# EAGLE design BOTTOM_1P (EAGLE 9.6.2)
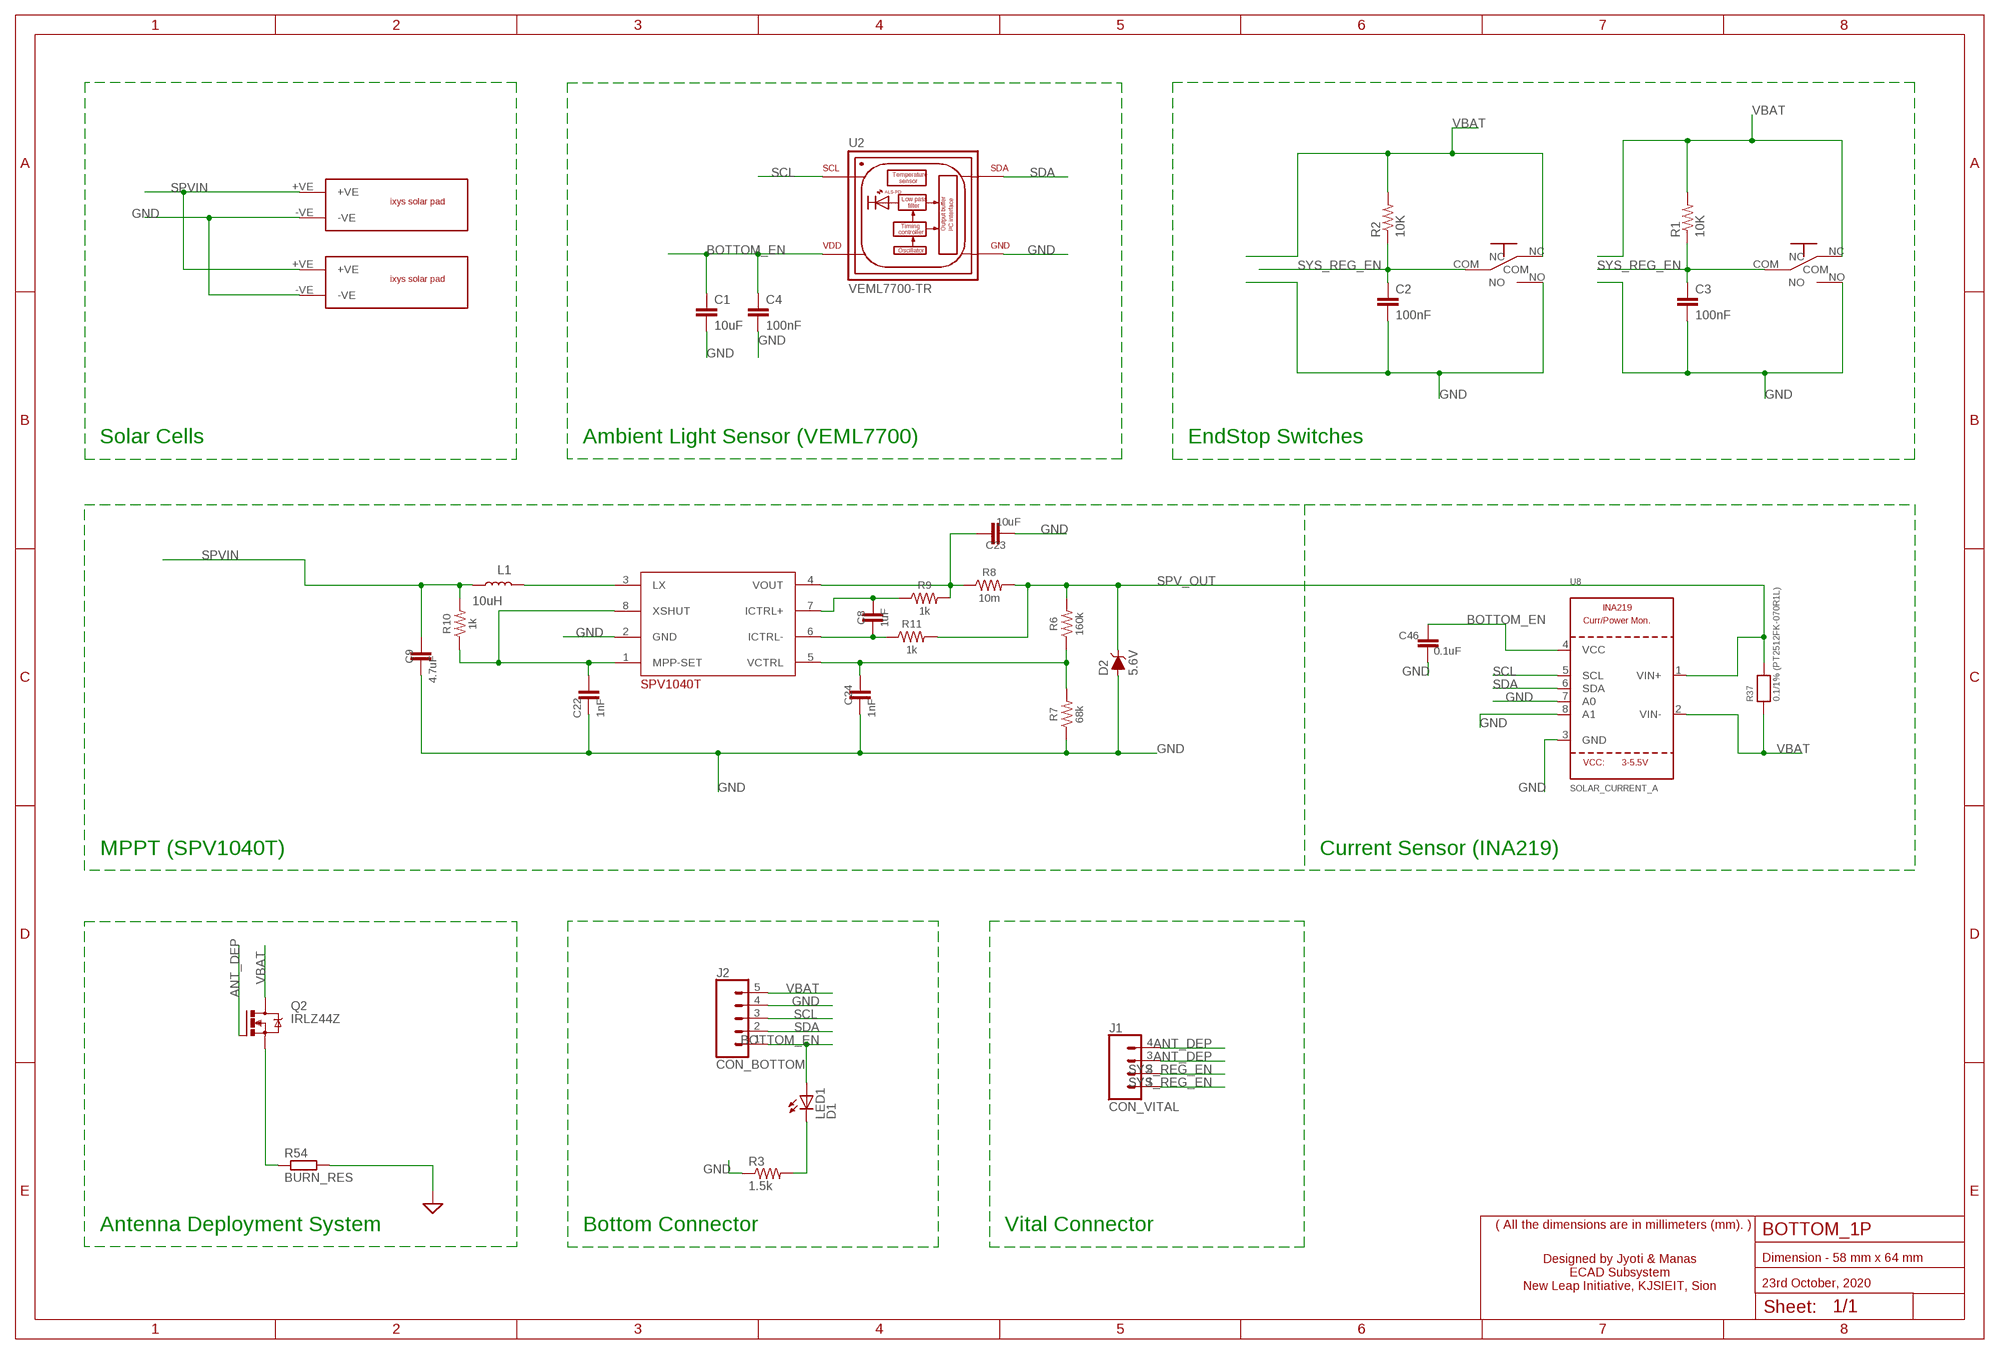
[diagram p0: schematic, sheet 1]

## Parts
C1  10uF  2.2NF/2200PF-0603-50V-10%  [0603]
C2  100nF  CAP0805  [0805]
C3  100nF  CAP0805  [0805]
C4  100nF  2.2NF/2200PF-0603-50V-10%  [0603]
C8  1uF  10UF-0603-6.3V-20%  [0603]
C9  4.7uF  10UF-0603-6.3V-20%  [0603]
C22  1nF  10UF-0603-6.3V-20%  [0603]
C23  10uF  10UF-0603-6.3V-20%  [0603]
C24  1nF  10UF-0603-6.3V-20%  [0603]
C46  0.1uF  10UF-0603-6.3V-20%  [0603]
D2  5.6V  DIODE-ZENER-MMSZ5232BS  [SOD-323]
ES1  OMRON-D2FA  [OMRON-D2F-A]
ES2  OMRON-D2FA  [OMRON-D2F-A]
J1  CON_VITAL  CONN_041.27MM  [1X04_1.27MM]
J2  CON_BOTTOM  CONN_051.27MM  [1X05_1.27MM]
L1  10uH  INDUCTOR-0603-33NH  [0603]
LED1  D1  LEDCHIP-LED0603  [CHIP-LED0603]
Q2  IRLZ44Z  [TO220BH]
R1  10K  RESISTOR  [0805]
R2  10K  RESISTOR  [0805]
R3  1.5k  R-US_R0603  [R0603]
R6  160k  RC0603JR-070RL  [RES_0603]
R7  68k  RC0603JR-070RL  [RES_0603]
R8  10m  RC0603JR-070RL  [RES_0603]
R9  1k  RC0603JR-070RL  [RES_0603]
R10  1k  RC0603JR-070RL  [RES_0603]
R11  1k  RC0603JR-070RL  [RES_0603]
R37  0.1/1% (PT2512FK-070R1L)  RESISTOR2512  [2512]
R54  BURN_RES  R-EU_0204/2V  [0204V]
SPV_A  SPV1040T_  [SOP65P640X120-8N]
U2  VEML7700-TR  [XDCR_VEML7700-TR]
U8  SOLAR_CURRENT_A  INA219  [SOT23-8]
U$1  IXYS  [IXYS]
U$2  IXYS  [IXYS]

## Nets
ANT_DEP: J1.3 J1.4 Q2.G
BOTTOM_EN: C1.1 C4.1 C46.1 J2.1 LED1.A U2.2(VDD) U8.4(VCC)
GND [vcc]: C1.2 C2.2 C3.2 C4.2 C9.2 C22.2 C23.2 C24.2 C46.2 D2.A ES1.NO ES2.NO J2.4 R3.1 R7.1 R54.2 SPV_A.2(GND) U2.3(GND) U8.3(GND) U8.7(A0) U8.8(A1) U$1.-VE U$2.-VE ; supply symbol labelled SUP
N$1: LED1.C R3.2
N$10: L1.2 SPV_A.3(LX)
N$19: Q2.S R54.1
N$31: C22.1 R10.1 SPV_A.1(MPP-SET) SPV_A.8(XSHUT)
N$32: C24.1 R6.1 R7.2 SPV_A.5(VCTRL)
N$34: C8.2 R11.1 SPV_A.6(ICTRL-)
N$35: C8.1 R9.1 SPV_A.7(ICTRL+)
N$36: C23.1 R8.1 R9.2 SPV_A.4(VOUT)
SCL: J2.3 U2.1(SCL) U8.5(SCL)
SDA: J2.2 U2.4(SDA) U8.6(SDA)
SPV_OUT: D2.C R6.2 R8.2 R11.2 R37.2 U8.1(VIN+)
SPVIN: C9.1 L1.1 R10.2 U$1.+VE U$2.+VE
SYS_REG_EN: C2.1 C3.1 ES1.COM ES2.COM J1.1 J1.2 R1.1 R2.1
VBAT: ES1.NC ES2.NC J2.5 Q2.D R1.2 R2.2 R37.1 U8.2(VIN-)

## Notes on the sheet
- Solar Cells | Ambient Light Sensor (VEML7700) | EndStop Switches
- MPPT (SPV1040T) | Current Sensor (INA219)
- Antenna Deployment System | Bottom Connector | Vital Connector | ( All the dimensions are in millimeters (mm). )
- Dimension - 58 mm x 64 mm
- Designed by Jyoti & Manas
  ECAD Subsystem
  New Leap Initiative, KJSIEIT, Sion
- 23rd October, 2020

## Library data of the parts
C1 C4 = SparkFun-Capacitors:2.2NF/2200PF: 2.2nF/2,200pF ceramic capacitors A capacitor is a passive two-terminal electrical component used to store electrical energy temporarily in an electric field.; PROD_ID: CAP-07877; VALUE: 2.2nF
C2 C3 = SparkFun:CAP: Capacitor Standard 0603 ceramic capacitor, and 0.1" leaded capacitor.
C8 C9 C22 C24 C46 = SparkFun-Capacitors:10UF: 10.0µF ceramic capacitors A capacitor is a passive two-terminal electrical component used to store electrical energy temporarily in an electric field.; PROD_ID: CAP-11015; VALUE: 10uF
C23 = SparkFun-Capacitors:10UF: 10.0µF ceramic capacitors A capacitor is a passive two-terminal electrical component used to store electrical energy temporarily in an electric field.; PROD_ID: CAP-11015
D2 = SparkFun-DiscreteSemi:DIODE-ZENER: Zener Diode A Zener diode allows current to flow from its anode to its cathode like a normal semiconductor diode, but it also permits current to flow in the reverse direction when its "Zener voltage" is reached. - WIkipedia; PROD_ID: DIO-12442
ES1 ES2 = reprap:OMRON-D2F
J1 = SparkFun-Connectors:CONN_04: Multi connection point. Often used as Generic Header-pin footprint for 0.1 inch spaced/style header connections On any of the 0.1 inch spaced packages, you can populate with these: Break Away Headers - Straight <https://www.sparkfun.com/products/116> (PRT-00116) Break Away Male Headers - Right Angle <https://www.sparkfun.com/products/553> (PRT-00553) Female Headers <https://www.sparkfun.com/products/115> (PRT-00115) Break Away Headers - Machine Pin <https://www.sparkfun.com/products/117> (PRT-00117) Break Away Female Headers - Swiss Machine Pin <https://www.sparkfun.com/products/743> (PRT-00743) For SCREWTERMINALS and SPRING TERMINALS visit here: Screw Terimnals on SparkFun.com <https://www.sparkfun.com/search/results?term=Screw+Terminals> (5mm/3.5mm/2.54mm spacing) This device is also useful as a general connection point to wire up your design to another part of your project. Our various solder wires solder well into these plated through hole pads. Hook-Up Wire - Assortment (Stranded, 22 AWG) <https://www.sparkfun.com/products/11375> (PRT-11375) Hook-Up Wire - Assortment (Solid Core, 22 AWG) <https://www.sparkfun.com/products/11367> (PRT-11367) View the entire wire category on our website here <https://www.sparkfun.com/categories/141> Special notes: Molex polarized connector foot print use with SKU : PRT-08231 with associated crimp pins and housings. 1MM SMD Version SKU: PRT-10208
J2 = SparkFun-Connectors:CONN_05: Multi connection point. Often used as Generic Header-pin footprint for 0.1 inch spaced/style header connections On any of the 0.1 inch spaced packages, you can populate with these: Break Away Headers - Straight <https://www.sparkfun.com/products/116> (PRT-00116) Break Away Male Headers - Right Angle <https://www.sparkfun.com/products/553> (PRT-00553) Female Headers <https://www.sparkfun.com/products/115> (PRT-00115) Break Away Headers - Machine Pin <https://www.sparkfun.com/products/117> (PRT-00117) Break Away Female Headers - Swiss Machine Pin <https://www.sparkfun.com/products/743> (PRT-00743) For SCREWTERMINALS and SPRING TERMINALS visit here: Screw Terimnals on SparkFun.com <https://www.sparkfun.com/search/results?term=Screw+Terminals> (5mm/3.5mm/2.54mm spacing) This device is also useful as a general connection point to wire up your design to another part of your project. Our various solder wires solder well into these plated through hole pads. Hook-Up Wire - Assortment (Stranded, 22 AWG) <https://www.sparkfun.com/products/11375> (PRT-11375) Hook-Up Wire - Assortment (Solid Core, 22 AWG) <https://www.sparkfun.com/products/11367> (PRT-11367) View the entire wire category on our website here <https://www.sparkfun.com/categories/141> Special notes: Molex polarized connector foot print use with SKU : PRT-08231 with associated crimp pins and housings. 1MM SMD Version SKU: PRT-10208
L1 = SparkFun-Coils:INDUCTOR: Inductors Resist changes in electrical current. Basically a coil of wire. SparkFun Products: SparkFun Load Cell Amplifier - HX711 <https://www.sparkfun.com/products/13879> IOIO-OTG - V2.2 <https://www.sparkfun.com/products/13613>; PROD_ID: NDUC-07874; VALUE: 33nH/±5%/500mA
LED1 = adafruit:LED: LED OSRAM: - CHIPLED LG R971, LG N971, LY N971, LG Q971, LY Q971, LO R971, LY R971 LH N974, LH R974 LS Q976, LO Q976, LY Q976 LO Q996 - Hyper CHIPLED LW Q18S LB Q993, LB Q99A, LB R99A - SideLED LS A670, LO A670, LY A670, LG A670, LP A670 LB A673, LV A673, LT A673, LW A673 LH A674 LY A675 LS A676, LA A676, LO A676, LY A676, LW A676 LS A679, LY A679, LG A679 - Hyper Micro SIDELED® LS Y876, LA Y876, LO Y876, LY Y876 LT Y87S - SmartLED LW L88C, LW L88S LB L89C, LB L89S, LG L890 LS L89K, LO L89K, LY L89K LS L896, LA L896, LO L896, LY L896 - TOPLED LS T670, LO T670, LY T670, LG T670, LP T670 LSG T670, LSP T670, LSY T670, LOP T670, LYG T670 LG T671, LOG T671, LSG T671 LB T673, LV T673, LT T673, LW T673 LH T674 LS T676, LA T676, LO T676, LY T676, LB T676, LH T676, LSB T676, LW T676 LB T67C, LV T67C, LT T67C, LS T67K, LO T67K, LY T67K, LW E67C LS E67B, LA E67B, LO E67B, LY E67B, LB E67C, LV E67C, LT E67C LW T67C LS T679, LY T679, LG T679 LS T770, LO T770, LY T770, LG T770, LP T770 LB T773, LV T773, LT T773, LW T773 LH T774 LS E675, LA E675, LY E675, LS T675 LS T776, LA T776, LO T776, LY T776, LB T776 LHGB T686 LT T68C, LB T68C - Hyper Mini TOPLED® LB M676 - Mini TOPLED Santana® LG M470 LS M47K, LO M47K, LY M47K Source: http://www.osram.convergy.de/
Q2 = transistor-power:IRLZ44Z: N-Channel HEXFET® Power MOSFET Logic Level AUTOMOTIVE MOSFET Source: http://www.irf.com/product-info/datasheets/data/irlz44zpbf.pdf
R1 R2 = SparkFun:RESISTOR: Resistor Basic schematic elements and footprints for 0603, 1206, and PTH 1/10th watt (small) resistors.
R3 = adafruit:R-US_: RESISTOR, American symbol
R6-R11 = Resistor_Capacitor:RC0603JR-070RL: RES SMD 0 OHM JUMPER 1/10W 0603 Manufacturer's datasheet <http://www.yageo.com/documents/recent/PYu-RC_Group_51_RoHS_L_10.pdf>; CREATED_BY: PCBLayout.com; DIGIKEY_PART_NUMBER: 311-0.0GRTR-ND; MANUFACTURER: Yageo; MPN: RC0603JR-070RL; PACKAGE: SMD 0603
R37 = microbuilder:RESISTOR: Resistors 0402 - 0402 Surface Mount Package 22 Ohm 1% 1/16W [Digikey: 311-22.0LRTR-ND] 33 Ohm 5% 1/16W 1.0K 5% 1/16W 1.5K 5% 1/16W 2.0K 1% 1/16W 10.0K 1% 1/16W [Digikey: 311-10.0KLRTR-ND] 10.0K 5% 1/16W [Digikey: RMCF0402JT10K0TR-ND] 12.1K 1% 1/16W [Digikey: 311-22.0LRTR-ND] 100.0K 5% 1/16W 0603 - 0603 Surface Mount Package 0 Ohm 1/10 Watt 1% Resistor 15 Ohm 1/10 Watt 1% Resistor 33 Ohm 1/10 Watt 1% Resistor 49.9 Ohm 1/10 Watt 1% Resistor 100 Ohm 1/10 Watt 1% Resistor 150 Ohm 1/10 Watt 1% Resistor 240 Ohm 1/10 Watt 1% Resistor 390 Ohm 1/10 Watt 1% Resistor 560 Ohm 1/10 Watt 1% Resistor 680 Ohm 1/10 Watt 1% Resistor 750 Ohm 1/10 Watt 1% Resistor 1.0K Ohm 1/10 Watt 1% Resistor 1.5K Ohm 1/10 Watt 1% Resistor 2.0K Ohm 1/10 Watt 1% Resistor 2.2K Ohm 1/10 Watt 1% Resistor 3.3K Ohm 1/10 Watt 1% Resistor 4.7K Ohm 1/10 Watt 1% Resistor 10.0K Ohm 1/10 Watt 1% Resistor 12.0K Ohm 1/10 Watt 1% Resistor 12.1K Ohm 1/10 Watt 1% Resistor 20.0K Ohm 1/10 Watt 1% Resistor 33.0K Ohm 1/10 Watt 1% Resistor 100.0K Ohm 1/10 Watt 1% Resistor 0805 - 0805 Surface Mount Package 0 Ohm 1/8 Watt 1% Resistor 33 Ohm 1/8 Watt 1% Resistor 100 Ohm 1/8 Watt 1% Resistor 150 Ohm 1/8 Watt 1% Resistor 200 Ohm 1/8 Watt 1% Resistor 240 Ohm 1/8 Watt 1% Resistor 330 Ohm 1/8 Watt 1% Resistor 390 Ohm 1/8 Watt 1% Resistor 470 Ohm 1/8 Watt 1% Resistor 1.0K Ohm 1/8 Watt 1% Resistor 1.5K Ohm 1/8 Watt 1% Resistor 2.0K Ohm 1/8 Watt 1% Resistor 4.7K Ohm 1/8 Watt 1% Resistor 5.1K Ohm 1/8 Watt 1% Resistor 5.6K Ohm 1/8 Watt 1% Resistor 10.0K Ohm 1/8 Watt 1% Resistor 22.0K Ohm 1/8 Watt 1% Resistor 33.0K Ohm 1/8 Watt 1% Resistor 100K Ohm 1/8 Watt 1% Resistor 1206 - 1206 Surface Mount Package 2012 - 2010 Surface Mount Package 0.11 Ohm 1/2 Watt 1% Resistor - Digikey: RHM.11UCT-ND
R54 = rcl:R-EU_: RESISTOR, European symbol; SPICEPREFIX: R
SPV_A = SPV1040T:SPV1040T_
U2 = VEML7700-TR:VEML7700-TR: Light to Digital Ambient Light Sensor Digital 0lux to 167000lux 8-Pin SMD T/R; ARROW_ELECTRONICS-PURCHASE-URL: https://snapeda.com/shop?store=Arrow+Electronics&id=620383; DESCRIPTION: Optical Sensor Ambient 545nm I²C 4-SMD, J-Lead; DIGI-KEY_PART_NUMBER: VEML7700CT-ND; DIGIKEY-PURCHASE-URL: https://snapeda.com/shop?store=DigiKey&id=620383; MF: Vishay; MOUSER-PURCHASE-URL: https://snapeda.com/shop?store=Mouser&id=620383; MP: VEML7700-TR; PACKAGE: SMD-4 Vishay
U8 = microbuilder:INA219: INA219 - I2C Current/Power Monitor Voltage Range: 0-26V Accuracy: 0.5% Temperature: -40°C - 125°C
U$1 U$2 = ixys:IXYS

## Net classes
1 vcc: width 0.254 mm

## Board
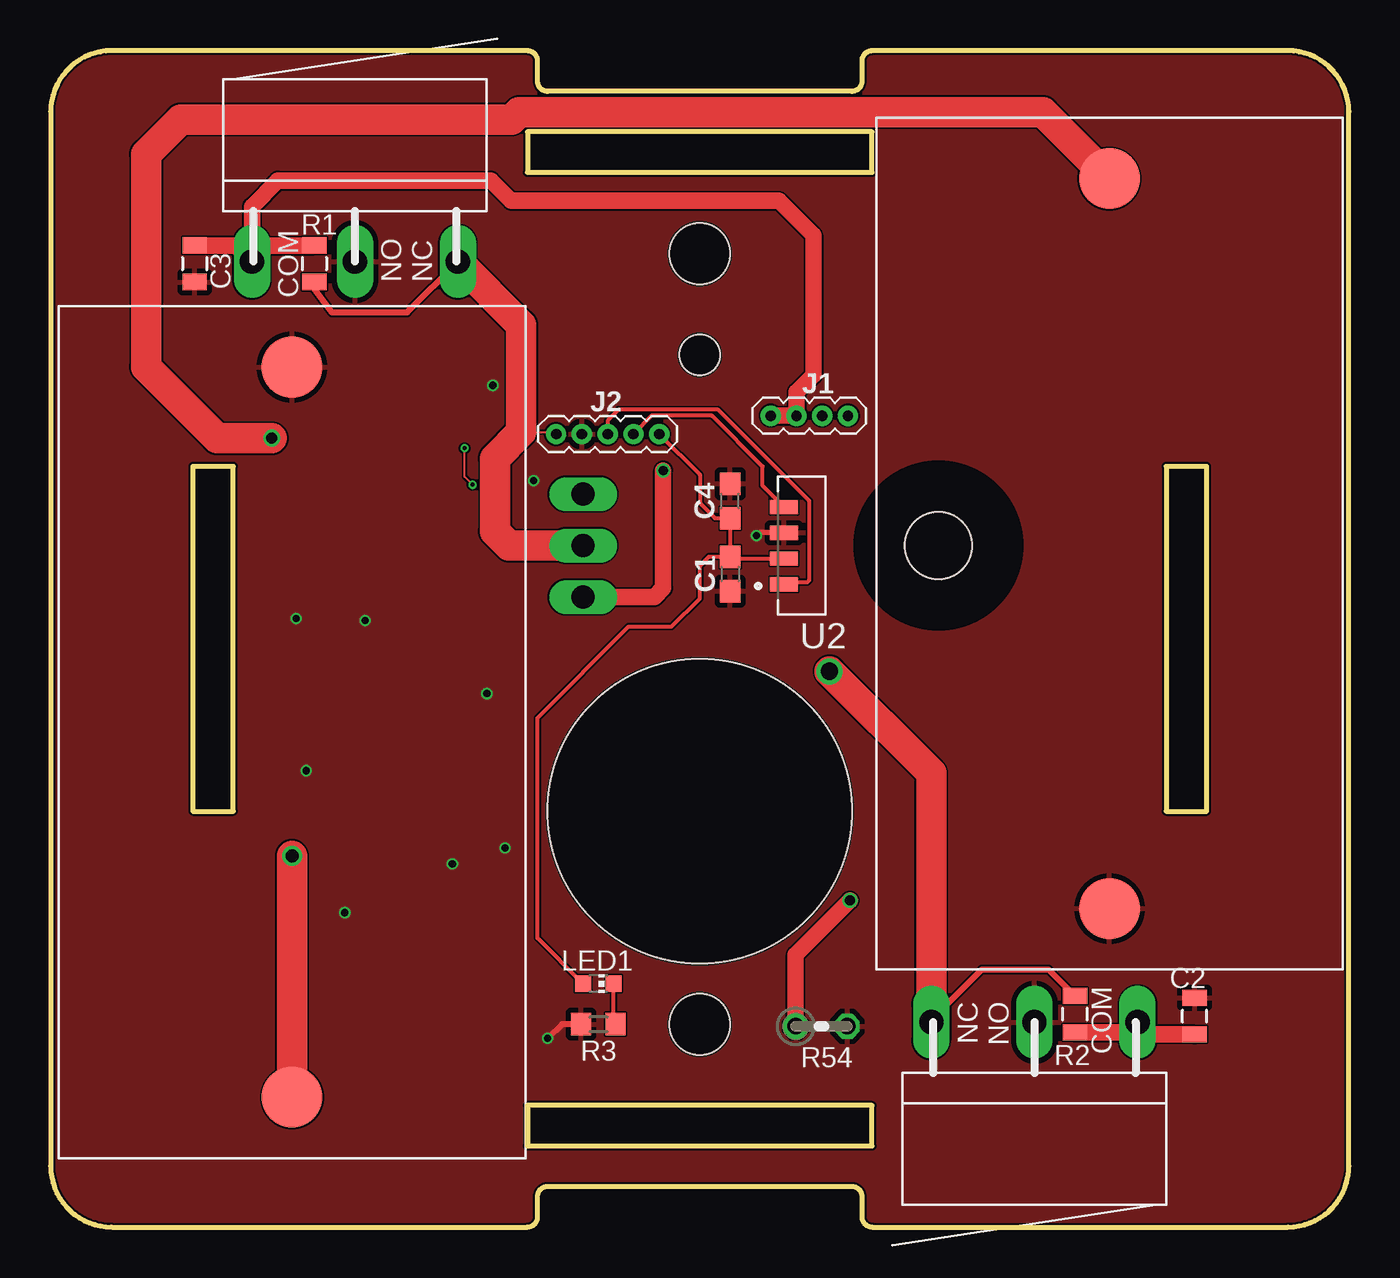
[diagram p1: board, top side]
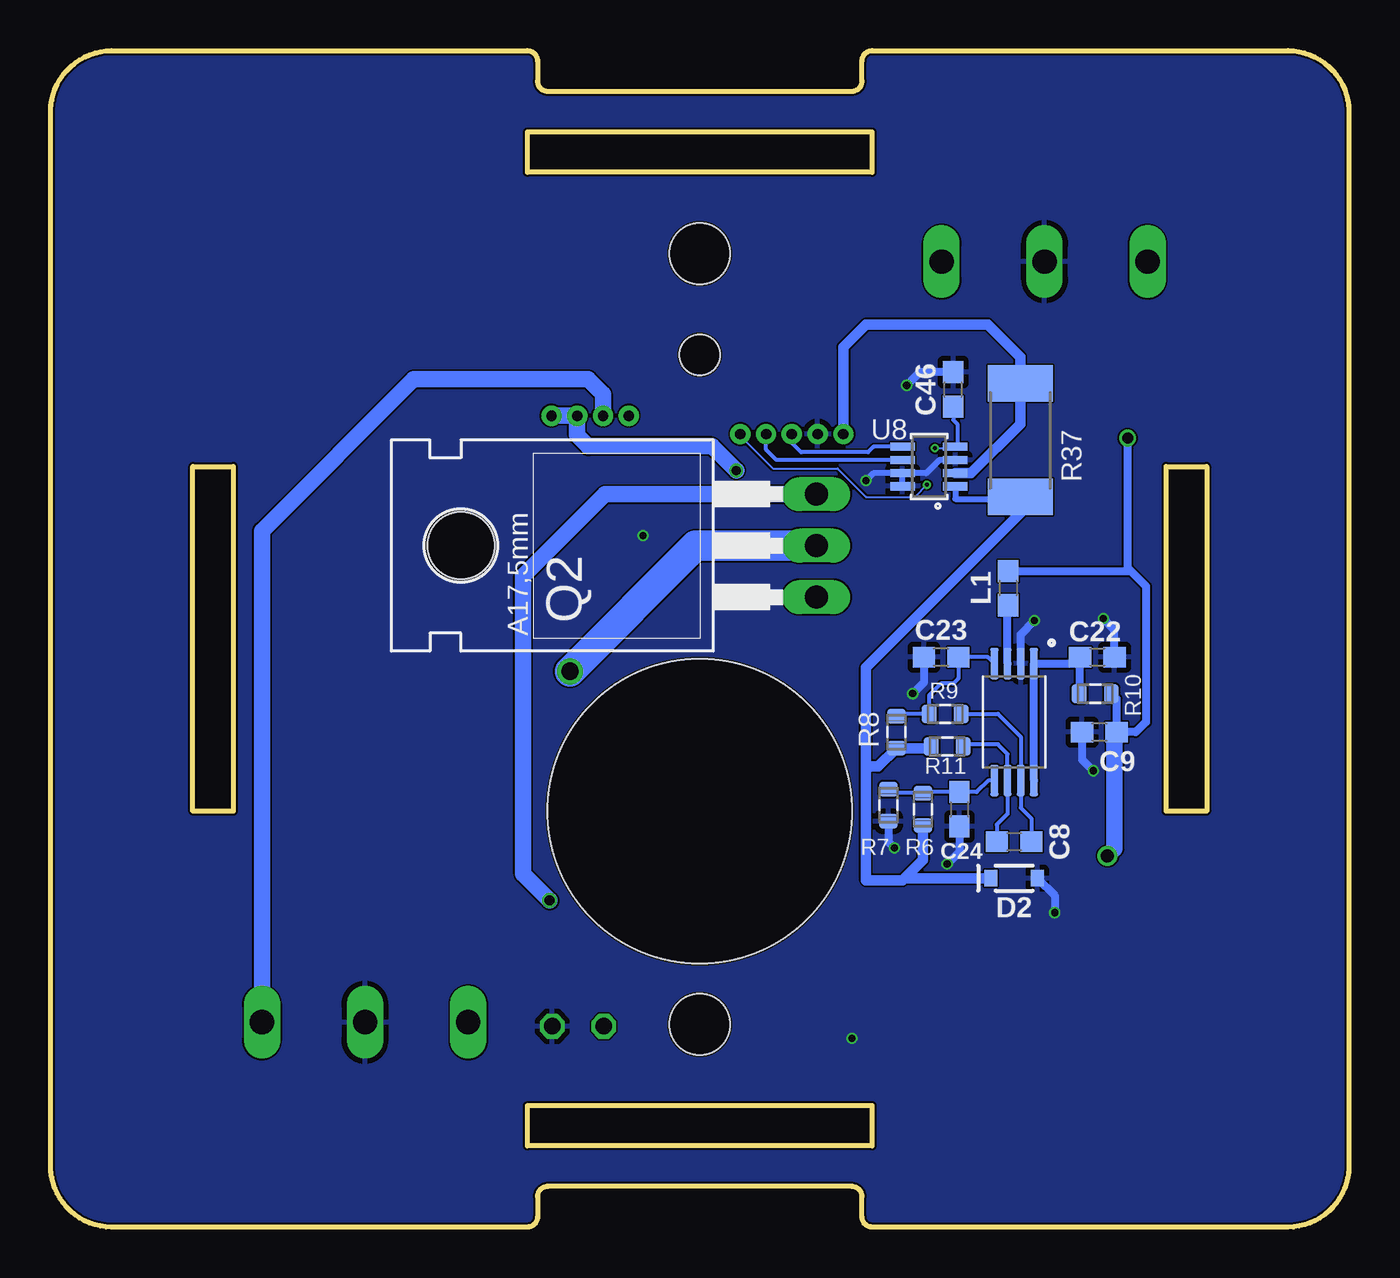
[diagram p2: board, bottom side, seen from below]

Size 64 x 58 mm. Coordinates in mm from the lower left corner, seen from the top.
Outline: 61,58 40.5,58 arc90 40,57.5 40,56.5 arc-90 39.5,56 24.5,56 arc-90 24,56.5 24,57.5 arc90 23.5,58 3,58 arc90 0,55 0,3 arc90 3,0 23.5,0 arc90 24,0.5 24,1.5 arc-90 24.5,2 39.5,2 arc-90 40,1.5 40,0.5 arc90 40.5,0 61,0 arc90 64,3 64,55 arc90 61,58
Outline: 40.5,52 40.5,54 23.5,54 23.5,52 40.5,52
Outline: 40.5,4 40.5,6 23.5,6 23.5,4 40.5,4
Outline: 55,20.5 57,20.5 57,37.5 55,37.5 55,20.5
Outline: 7,20.5 9,20.5 9,37.5 7,37.5 7,20.5
Copper layers (1*16): Top 0.035mm / dielectric 0.2mm / Bottom 0.035mm
Design rules "jlcpcb-2-layer": minimum track width 3.5mil, minimum drill 0.2mm, track to track 3.5mil, track to pad 5mil, pad to pad 5mil, via to via 5mil, smd to smd 0mil, copper to edge 0.1mm, drill to drill 5mil, minimum pad ring 4mil, minimum via ring 4mil, stop-mask expansion 3mil, vias tented up to drill 100mil, thermal gap 10mil
Holes 15 mm at 32,20.5
Holes 3 mm at 32,10 32,48
Holes 2 mm at 32,43

### Footprints (pad centres in the part's own frame; a part is rotated, then mirrored left to right if it is on the bottom)
0603 = smd 1.1 x 1: 1 -0.85,0; 2 0.85,0
0805 = smd 0.8 x 1.2: 1 -0.9,0; 2 0.9,0
SOD-323 = smd 0.63 x 0.83: A 1.15,0; C -1.15,0
OMRON-D2F-A = drill 1.2 long: COM -5.08,0; NC 5.08,0; NO 0,0
1X04_1.27MM = drill 0.508 pad 1: 1 0,0; 2 1.27,0; 3 2.54,0; 4 3.81,0
1X05_1.27MM = drill 0.508 pad 1: 1 0,0; 2 1.27,0; 3 2.54,0; 4 3.81,0; 5 5.08,0
CHIP-LED0603 = smd 0.8 x 0.8: A 0,-0.75; C 0,0.75
TO220BH = drill 1.118 long: D 0,-6.35; G -2.54,-6.35; S 2.54,-6.35 | hole 3.302: 0,11.176
R0603 = smd 1 x 1.1: 1 -0.85,0; 2 0.85,0
RES_0603 = smd 0.74 x 0.93: 1 -0.795,0; 2 0.795,0
2512 = smd 1.8 x 3.2: 1 -2.8,0; 2 2.8,0
0204V = drill 0.813 octagon: 1 -1.27,0; 2 1.27,0
SOP65P640X120-8N = smd 1.56 x 0.41: 1 -2.88,0.975; 2 -2.88,0.325; 3 -2.88,-0.325; 4 -2.88,-0.975; 5 2.88,-0.975; 6 2.88,-0.325; 7 2.88,0.325; 8 2.88,0.975
XDCR_VEML7700-TR = smd 1.4 x 0.7: 1 0.55,1.905; 2 0.55,0.635; 3 0.55,-0.635; 4 0.55,-1.905
SOT23-8 = smd 0.4 x 1.2: 1 -0.975,-1.3; 2 -0.325,-1.3; 3 0.325,-1.3; 4 0.975,-1.3; 5 0.975,1.3; 6 0.325,1.3; 7 -0.325,1.3; 8 -0.975,1.3
IXYS = smd 3 x 3: +VE 3,11.5; -VE 39,11.5

### Placement (x,y rotation side)
C1  33.5,32.2 270 top
C2  56.4,10.4 90 top
C3  7.1,47.5 270 top
C4  33.5,35.8 90 top
C8  16.5,19 180 bottom
C9  12.3,24.4 180 bottom
C22  12.4,28.1 0 bottom
C23  20.1,28.1 180 bottom
C24  19.2,20.6 270 bottom
C46  19.5,41.3 90 bottom
D2  16.5,17.2 0 bottom
ES1  48.5,10.1 180 top
ES2  15,47.6 0 top
J1  35.5,40 0 top
J2  30,39.1 180 top
L1  16.8,31.5 270 bottom
LED1  27,12 270 top
Q2  32.6,33.6 90 bottom
R1  13,47.5 270 top
R2  50.5,10.5 90 top
R3  27,10 0 top
R6  21,20.6 270 bottom
R7  22.7,20.8 90 bottom
R8  22.3,24.4 270 bottom
R9  19.9,25.3 180 bottom
R10  12.5,26.3 0 bottom
R11  19.8,23.7 180 bottom
R37  16.2,38.8 270 bottom
R54  38,9.9 0 top
SPV_A  16.5,24.9 270 bottom
U2  36.7,33.6 180 top
U8  20.7,37.5 90 bottom
U$1  40.7,54.7 270 top
U$2  23.4,3.4 90 top

### Tracks (layer width: path | path; a pad name or v marks a point on that pad's centre or on a via)
ANT_DEP  (via drill 0.45)
  Top 0.813: Q2.G 29.76,31.06 30.2,31.5 v30.2,37.3
  Bottom 0.813: v30.2,37.3 31.4,38.5 37.5,38.5 38.04,39.04 J1.3 J1.4
BOTTOM_EN  (via drill 0.2)
  Top 0.089: v20.4,38.4 20.4,37 v20.8,36.6
  Top 0.2: C1.1 C4.1 32.75,34.95 32,35.7 32,37.1 J2.1 | C1.1 33.59,32.97 U2.2 | LED1.A 24,14.25 24,25.1 28.5,29.6 30.6,29.6 32,31 32,32.6 32.45,33.05 C1.1
  Bottom 0.089: v20.4,38.4 19.4,38.4 U8.4 | v20.8,36.6 21.4,36 23.8,36 25.2,37.4 28.4,37.4 30,39 J2.1
  Bottom 0.2: C46.1 19.5,39.8 19.3,39.6 19.3,38.58 U8.4
GND  (via drill 0.35)
  Top 0.254: U2.3 34.94,34.23 v34.8,34.1
  Top 0.305: R3.1 25.2,10 v24.5,9.3
  Bottom 0.305: U8.3 20.18,37.83 20.82,37.17 U8.7 | U8.8 U8.7 | U8.7 23.43,37.17 v23.8,36.8
  Bottom 0.406: C22.2 11.55,29.45 v12.1,30 | C9.2 13.15,23.05 v12.6,22.5 | C23.2 20.95,26.85 v21.5,26.3 | R7.1 22.7,19 v22.4,18.7 | C24.2 19.2,18.5 v19.8,17.9 | D2.A 14.5,16.35 v14.5,15.5 | SPV_A.2 16.18,29.23 v15.5,29.9 | C46.2 21.15,42.15 v21.8,41.5
  pour Bottom: -9.8,-2.6 -9.8,66 arc-90 -9.3,66.5 75.1,66.5 75.1,-2.1 arc-90 74.6,-2.6
  pour Top: -9.8,66.5 74.8,66.5 75.1,66.2 75.1,-2.2 75.2,-2.3 -8.7,-2.3 -9.9,-1.1 -9.9,66.4
N$1
  Top 0.2: R3.2 27.75,10.1 LED1.C
N$10
  Bottom 0.2: 16.82,30.62 L1.2
  Bottom 0.406: SPV_A.3 16.82,30.62
N$19  (via drill 0.5)
  Top 0.813: R54.1 36.73,13.43 v39.4,16.1
  Bottom 0.813: v39.4,16.1 40.7,17.4 40.7,32.1 36.66,36.14 Q2.S
N$31
  Bottom 0.406: R10.1 13.29,28.05 C22.1 13.57,27.78 SPV_A.1 SPV_A.8
N$32
  Bottom 0.2: SPV_A.5 17.78,22.02 18.35,21.45 C24.1 20.95,21.45 R6.1 22.5,21.39 R7.2
N$34
  Bottom 0.2: C8.2 17.35,19.85 16.82,20.38 SPV_A.6 16.82,23.32 17.3,23.8 18.91,23.8 R11.1
N$35
  Bottom 0.2: C8.1 15.65,20.15 16.18,20.68 SPV_A.7 16.18,24.18 17.3,25.3 R9.1
N$36
  Bottom 0.2: SPV_A.4 17.8,28.1 C23.1 19.25,27.05 19.5,26.8 20.1,26.8 20.7,26.2 R9.2 22.2,25.3 R8.1
SCL
  Top 0.2: U2.1 36.26,31.8 37.3,31.8 37.4,31.9 37.4,35.8 32.9,40.3 28,40.3 27.46,39.76 J2.3
  Bottom 0.2: U8.5 23.43,38.48 23.7,38.2 27,38.2 27.46,38.66 J2.3
SDA
  Top 0.2: U2.4 35.1,36.55 35.1,37.5 32.6,40 29.63,40 J2.2
  Bottom 0.2: U8.6 28.23,37.83 28.73,38.33 J2.2
SPV_OUT
  Bottom 0.305: U8.1 19.4,35.9 16.3,35.9 R37.2
  Bottom 0.508: 23.8,22.7 23.8,17.1 22,17.1 21.9,17.2 | 23.8,22.7 23.8,27.6 16.2,35.2 R37.2 | R6.2 21,18.1 21.9,17.2 | 23.8,22.7 23.2,22.7 R8.2 20.69,23.61 R11.2 | D2.C 21.9,17.2
SPVIN  (via drill 0.55, 0.65)
  Top 1.5: U$2.+VE v11.9,18.3 | U$1.+VE 48.92,54.98 23.09,54.98 22.72,54.6 6.4,54.6 4.7,52.9 4.7,42.4 8.2,38.9 v10.9,38.9
  Bottom 0.406: R10.2 11.45,26.05 C9.1 10.5,24.4 10,24.9 10,31.6 10.75,32.35 | L1.1 10.75,32.35 | 10.75,32.35 10.9,32.5 v10.9,38.9
  Bottom 0.813: C9.1 11.55,24.3 11.55,18.65 v11.9,18.3
SYS_REG_EN
  Top 0.813: R2.1 53.08,9.6 ES1.COM 54.18,9.5 C2.1 | J1.1 J1.2 36.77,41.17 37.6,42 37.6,48.9 35.9,50.6 22.7,50.6 21.7,51.6 11.2,51.6 9.92,50.32 ES2.COM | ES2.COM 9.12,48.4 C3.1 | ES2.COM 10.72,48.4 R1.1
  Bottom 0.813: ES1.COM 53.58,34.32 46.1,41.8 37.5,41.8 36.77,41.07 J1.2
VBAT  (via drill 0.85)
  Top 0.089: 23.2,39.2 24.82,39.2 J2.5
  Top 0.305: R1.2 13,46.26 13.85,45.1 17.58,45.1 ES2.NC | ES1.NC 43.42,10.22 45.9,12.7 49.2,12.7 R2.2
  Top 1.5: ES2.NC 23.2,44.48 23.2,39.2 21.9,37.9 21.9,34.3 22.6,33.6 Q2.D | ES1.NC 43.42,22.38 v38.4,27.4
  Bottom 0.508: U8.2 18.62,37.17 16.2,39.6 R37.1 16.2,42.9 17.8,44.5 23.8,44.5 24.92,43.38 J2.5
  Bottom 1.5: v38.4,27.4 32.2,33.6 Q2.D